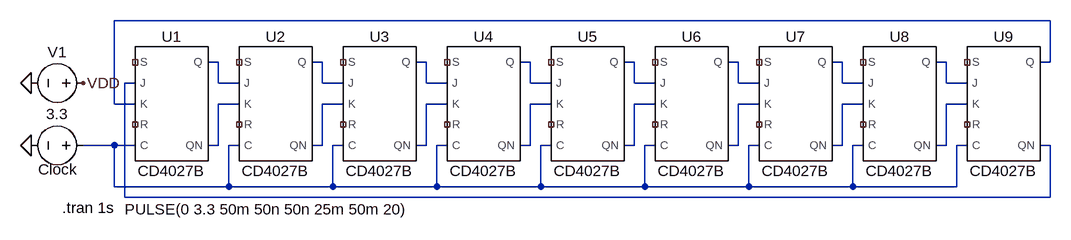
[diagram p0: schematic JohnsonCounterJK.asc]
JohnsonCounterJK.asc, the LTspice schematic file:
Version 4
SHEET 1 2252 680
WIRE 1536 112 96 112
WIRE 256 176 240 176
WIRE 416 176 400 176
WIRE 576 176 560 176
WIRE 736 176 720 176
WIRE 896 176 880 176
WIRE 1056 176 1040 176
WIRE 1216 176 1200 176
WIRE 1376 176 1360 176
WIRE 1536 176 1536 112
WIRE 1536 176 1520 176
WIRE 128 208 112 208
WIRE 256 208 256 176
WIRE 288 208 256 208
WIRE 416 208 416 176
WIRE 448 208 416 208
WIRE 576 208 576 176
WIRE 608 208 576 208
WIRE 736 208 736 176
WIRE 768 208 736 208
WIRE 896 208 896 176
WIRE 928 208 896 208
WIRE 1056 208 1056 176
WIRE 1088 208 1056 208
WIRE 1216 208 1216 176
WIRE 1248 208 1216 208
WIRE 1376 208 1376 176
WIRE 1408 208 1376 208
WIRE 96 240 96 112
WIRE 128 240 96 240
WIRE 288 240 256 240
WIRE 448 240 416 240
WIRE 608 240 576 240
WIRE 768 240 736 240
WIRE 928 240 896 240
WIRE 1088 240 1056 240
WIRE 1248 240 1216 240
WIRE 1408 240 1376 240
WIRE 96 304 48 304
WIRE 128 304 96 304
WIRE 256 304 256 240
WIRE 256 304 240 304
WIRE 288 304 272 304
WIRE 416 304 416 240
WIRE 416 304 400 304
WIRE 448 304 432 304
WIRE 576 304 576 240
WIRE 576 304 560 304
WIRE 608 304 592 304
WIRE 736 304 736 240
WIRE 736 304 720 304
WIRE 768 304 752 304
WIRE 896 304 896 240
WIRE 896 304 880 304
WIRE 928 304 912 304
WIRE 1056 304 1056 240
WIRE 1056 304 1040 304
WIRE 1088 304 1072 304
WIRE 1216 304 1216 240
WIRE 1216 304 1200 304
WIRE 1248 304 1232 304
WIRE 1376 304 1376 240
WIRE 1376 304 1360 304
WIRE 1408 304 1392 304
WIRE 1536 304 1520 304
WIRE 96 368 96 304
WIRE 272 368 272 304
WIRE 272 368 96 368
WIRE 432 368 432 304
WIRE 432 368 272 368
WIRE 592 368 592 304
WIRE 592 368 432 368
WIRE 752 368 752 304
WIRE 752 368 592 368
WIRE 912 368 912 304
WIRE 912 368 752 368
WIRE 1072 368 1072 304
WIRE 1072 368 912 368
WIRE 1232 368 1232 304
WIRE 1232 368 1072 368
WIRE 1392 368 1392 304
WIRE 1392 368 1232 368
WIRE 112 384 112 208
WIRE 1536 384 1536 304
WIRE 1536 384 112 384
FLAG -32 304 0
FLAG -32 208 0
FLAG 48 208 VDD
SYMBOL voltage 64 208 R90
WINDOW 0 -32 56 VBottom 2
WINDOW 3 32 56 VTop 2
SYMATTR InstName V1
SYMATTR Value 3.3
SYMBOL voltage 64 304 R90
WINDOW 0 53 55 VBottom 2
WINDOW 3 83 -267 VTop 2
SYMATTR InstName Clock
SYMATTR Value PULSE(0 3.3 50m 50n 50n 25m 50m 20)
SYMBOL CD4027B 176 240 R0
SYMATTR InstName U1
SYMBOL CD4027B 336 240 R0
SYMATTR InstName U2
SYMBOL CD4027B 496 240 R0
SYMATTR InstName U3
SYMBOL CD4027B 656 240 R0
SYMATTR InstName U4
SYMBOL CD4027B 816 240 R0
SYMATTR InstName U5
SYMBOL CD4027B 976 240 R0
SYMATTR InstName U6
SYMBOL CD4027B 1136 240 R0
SYMATTR InstName U7
SYMBOL CD4027B 1296 240 R0
SYMATTR InstName U8
SYMBOL CD4027B 1456 240 R0
SYMATTR InstName U9
TEXT 16 400 Left 2 !.tran 1s

The netlist it stands for:
* JohnsonCounterJK.asc
V1 VDD 0 3.3
V§Clock N019 0 PULSE(0 3.3 50m 50n 50n 25m 50m 20)
XU1 NC_01 N010 N019 N001 NC_02 N002 N011 VDD 0 CD4027B VDD=3.3 SPEED=0.1 TRIPDT=1e-9  ; pins S J C K R Q QN
XU2 NC_03 N002 N019 N011 NC_04 N003 N012 VDD 0 CD4027B VDD=3.3 SPEED=0.1 TRIPDT=1e-9  ; pins S J C K R Q QN
XU3 NC_05 N003 N019 N012 NC_06 N004 N013 VDD 0 CD4027B VDD=3.3 SPEED=0.1 TRIPDT=1e-9  ; pins S J C K R Q QN
XU4 NC_07 N004 N019 N013 NC_08 N005 N014 VDD 0 CD4027B VDD=3.3 SPEED=0.1 TRIPDT=1e-9  ; pins S J C K R Q QN
XU5 NC_09 N005 N019 N014 NC_10 N006 N015 VDD 0 CD4027B VDD=3.3 SPEED=0.1 TRIPDT=1e-9  ; pins S J C K R Q QN
XU6 NC_11 N006 N019 N015 NC_12 N007 N016 VDD 0 CD4027B VDD=3.3 SPEED=0.1 TRIPDT=1e-9  ; pins S J C K R Q QN
XU7 NC_13 N007 N019 N016 NC_14 N008 N017 VDD 0 CD4027B VDD=3.3 SPEED=0.1 TRIPDT=1e-9  ; pins S J C K R Q QN
XU8 NC_15 N008 N019 N017 NC_16 N009 N018 VDD 0 CD4027B VDD=3.3 SPEED=0.1 TRIPDT=1e-9  ; pins S J C K R Q QN
XU9 NC_17 N009 N019 N018 NC_18 N001 N010 VDD 0 CD4027B VDD=3.3 SPEED=0.1 TRIPDT=1e-9  ; pins S J C K R Q QN
.tran 1s
.lib CD4000_v.lib
.backanno
.end